# Altium schematic sheet [2]_FPGA.SchDoc: FPGA
size A3; Author: Eladio Delgado Mingorance; CompanyName: Mareldem Technologies; Organization: Mareldem Technologies; Revision: 1.0A; SheetNumber: 2; SheetTotal: 5
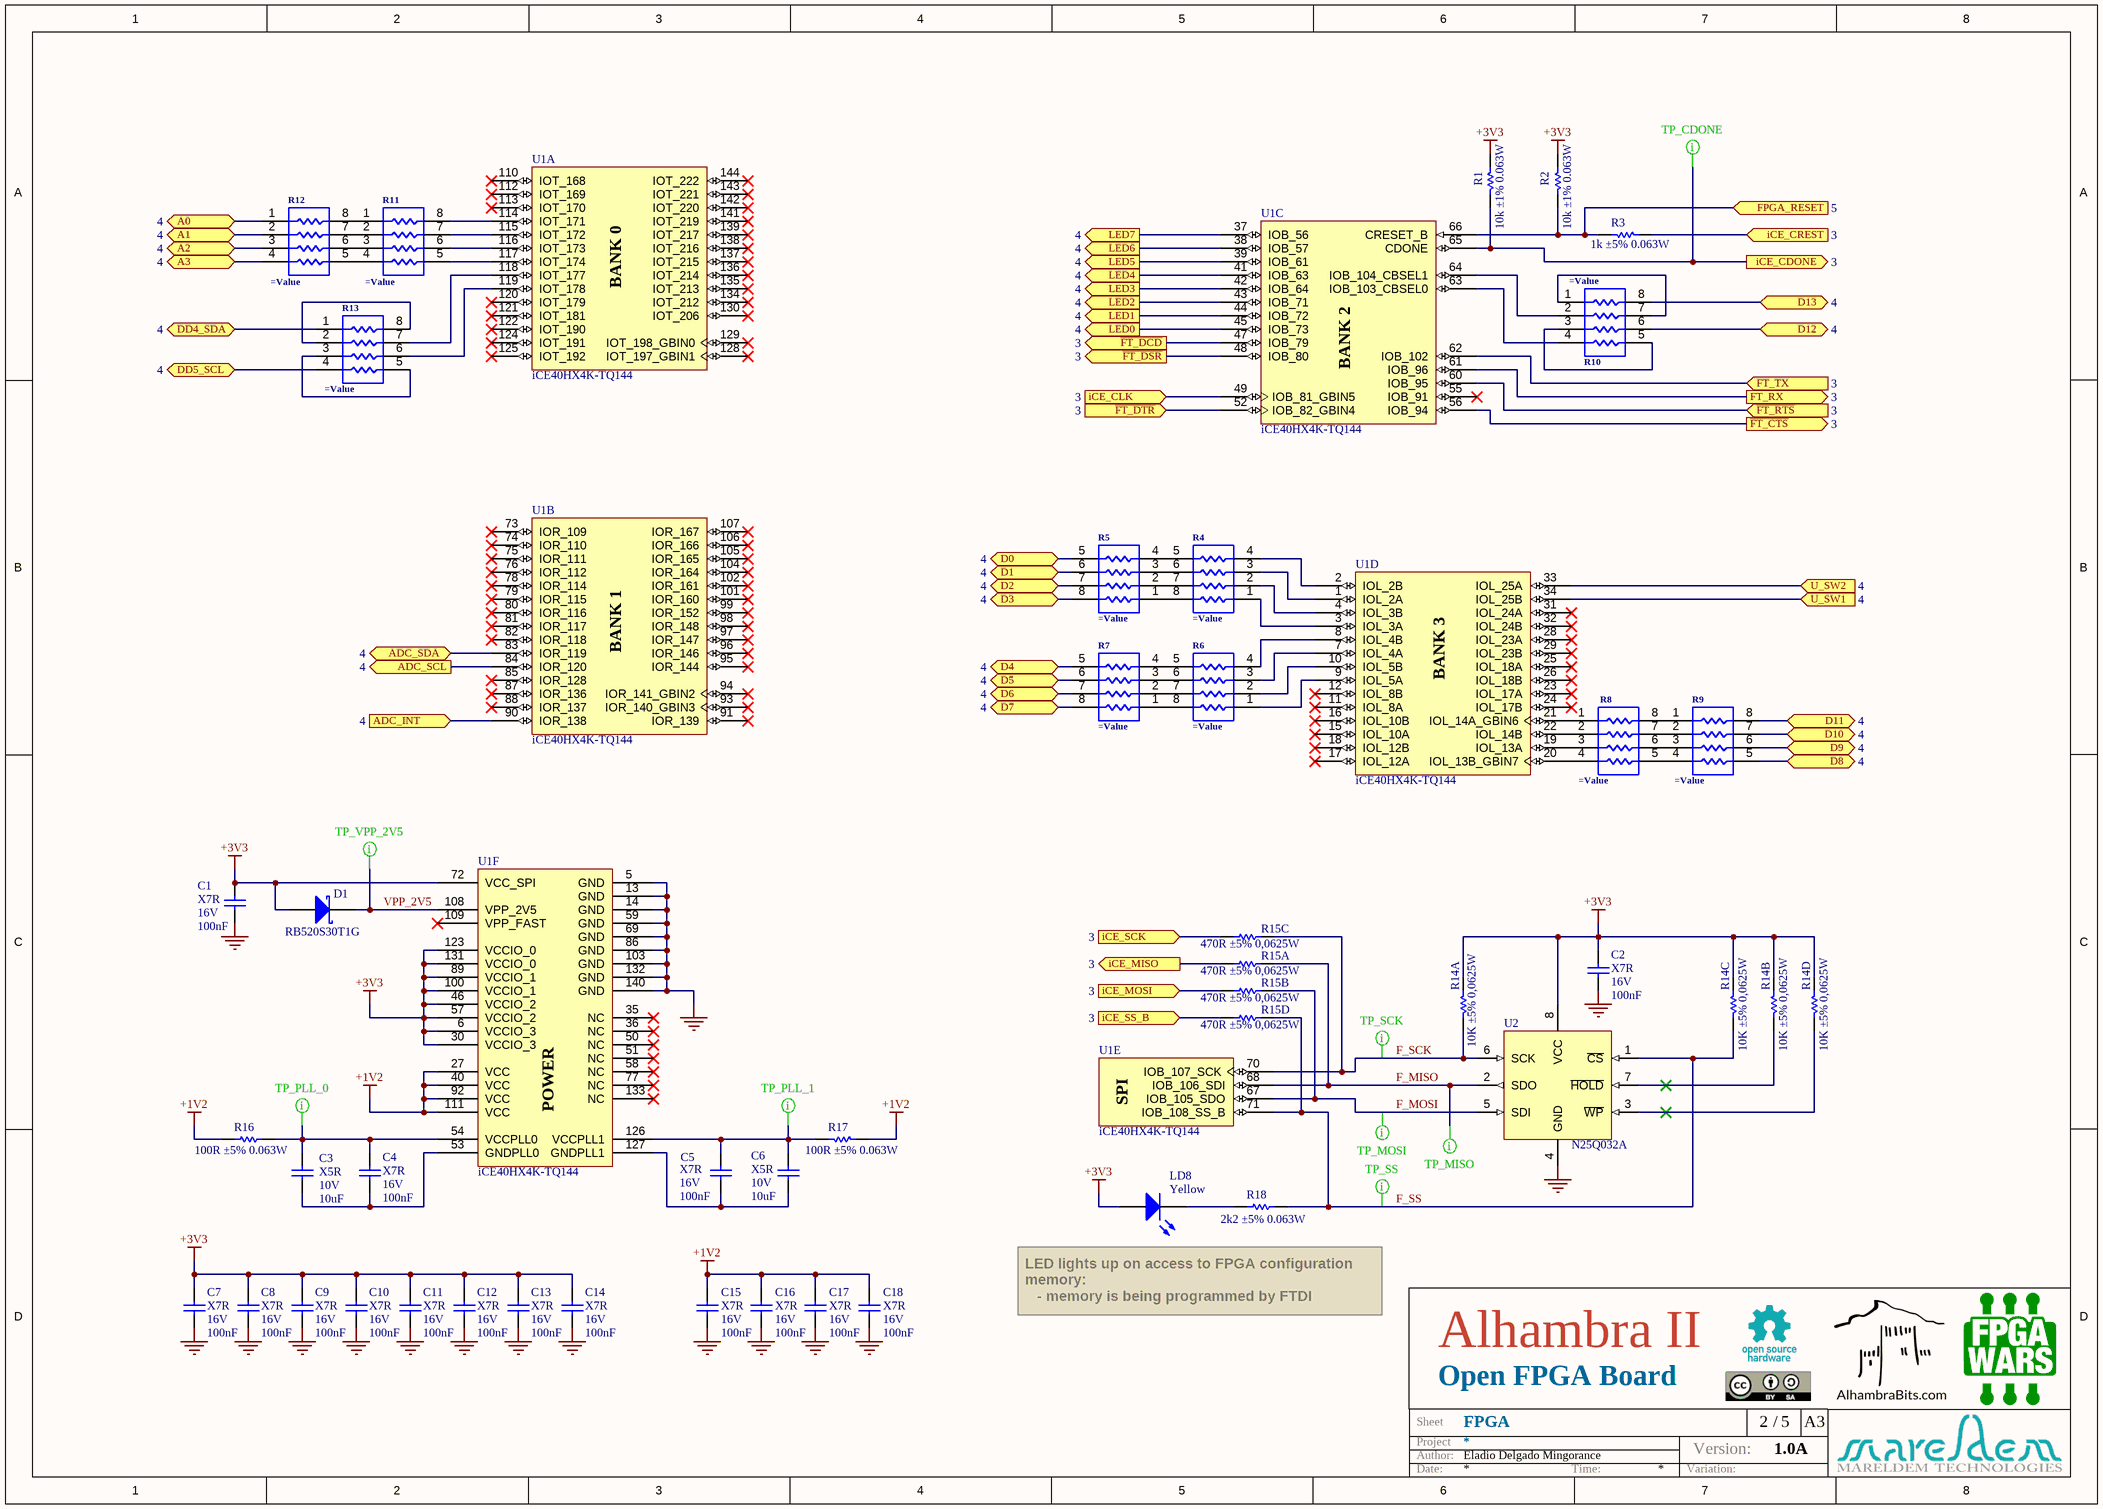
[diagram p0: [2]_FPGA.SchDoc]

## Parts
C1  Dielectric: X7R  Voltage: 16V  Capacitance: 100nF  [C0402]  (hidden comment: Capacitor)
C2  Dielectric: X7R  Voltage: 16V  Capacitance: 100nF  [C0402]  (hidden comment: Capacitor)
C3  Dielectric: X5R  Voltage: 10V  Capacitance: 10uF  [C0603]  (hidden comment: Capacitor)
C4  Dielectric: X7R  Voltage: 16V  Capacitance: 100nF  [C0402]  (hidden comment: Capacitor)
C5  Dielectric: X7R  Voltage: 16V  Capacitance: 100nF  [C0402]  (hidden comment: Capacitor)
C6  Dielectric: X5R  Voltage: 10V  Capacitance: 10uF  [C0603]  (hidden comment: Capacitor)
C7  Dielectric: X7R  Voltage: 16V  Capacitance: 100nF  [C0402]  (hidden comment: Capacitor)
C8  Dielectric: X7R  Voltage: 16V  Capacitance: 100nF  [C0402]  (hidden comment: Capacitor)
C9  Dielectric: X7R  Voltage: 16V  Capacitance: 100nF  [C0402]  (hidden comment: Capacitor)
C10  Dielectric: X7R  Voltage: 16V  Capacitance: 100nF  [C0402]  (hidden comment: Capacitor)
C11  Dielectric: X7R  Voltage: 16V  Capacitance: 100nF  [C0402]  (hidden comment: Capacitor)
C12  Dielectric: X7R  Voltage: 16V  Capacitance: 100nF  [C0402]  (hidden comment: Capacitor)
C13  Dielectric: X7R  Voltage: 16V  Capacitance: 100nF  [C0402]  (hidden comment: Capacitor)
C14  Dielectric: X7R  Voltage: 16V  Capacitance: 100nF  [C0402]  (hidden comment: Capacitor)
C15  Dielectric: X7R  Voltage: 16V  Capacitance: 100nF  [C0402]  (hidden comment: Capacitor)
C16  Dielectric: X7R  Voltage: 16V  Capacitance: 100nF  [C0402]  (hidden comment: Capacitor)
C17  Dielectric: X7R  Voltage: 16V  Capacitance: 100nF  [C0402]  (hidden comment: Capacitor)
C18  Dielectric: X7R  Voltage: 16V  Capacitance: 100nF  [C0402]  (hidden comment: Capacitor)
D1  RB520S30T1G  [SOD523]
LD8  Yellow  [LED0603]
R1  value 10k ±1% 0.063W  [R0402]  (hidden comment: Resistor)
R2  value 10k ±1% 0.063W  [R0402]  (hidden comment: Resistor)
R3  value 1k ±5% 0.063W  [R0402]  (hidden comment: Resistor)
R4  (no value)  [4xArray_1206_Convex]
R5  (no value)  [4xArray_1206_Convex]
R6  (no value)  [4xArray_1206_Convex]
R7  (no value)  [4xArray_1206_Convex]
R8  (no value)  [4xArray_1206_Convex]
R9  (no value)  [4xArray_1206_Convex]
R10  (no value)  [4xArray_1206_Convex]
R11  (no value)  [4xArray_1206_Convex]
R12  (no value)  [4xArray_1206_Convex]
R13  (no value)  [4xArray_1206_Convex]
R14  value 10K ±5% 0,0625W  [4xArray_1206_Convex]  (hidden comment: Resistor_x4_Parts)  (parts A,B,C,D of 4)
R15  value 470R ±5% 0,0625W  [4xArray_1206_Convex]  (hidden comment: Resistor_x4_Parts)  (parts A,B,C,D of 4)
R16  value 100R ±5% 0.063W  [R0402]  (hidden comment: Resistor)
R17  value 100R ±5% 0.063W  [R0402]  (hidden comment: Resistor)
R18  value 2k2 ±5% 0.063W  [R0402]  (hidden comment: Resistor)
U1  iCE40HX4K-TQ144  [TQFP-144_HX4K_FPGAwars]  (parts A,B,C,D,E,F of 6)
U2  N25Q032A  [DFN-8 6x5mm]

## Ports
A0 (bidir, see 4), A1 (bidir, see 4), A2 (bidir, see 4), A3 (bidir, see 4), ADC_INT (in, see 4), ADC_SCL (out, see 4), ADC_SDA (bidir, see 4), D0 (bidir, see 4), D1 (bidir, see 4), D2 (bidir, see 4), D3 (bidir, see 4), D4 (bidir, see 4), D5 (bidir, see 4), D6 (bidir, see 4), D7 (bidir, see 4), D8 (bidir, see 4), D9 (bidir, see 4), D10 (bidir, see 4), D11 (bidir, see 4), D12 (bidir, see 4), D13 (bidir, see 4), DD4_SDA (bidir, see 4), DD5_SCL (bidir, see 4), FPGA_RESET (in, see 5), FT_RX (out, see 3), FT_TX (in, see 3), iCE_CDONE (out, see 3), iCE_CLK (in, see 3), iCE_CREST (in, see 3), iCE_MISO (out, see 3), iCE_MOSI (in, see 3), iCE_SCK (in, see 3), iCE_SS_B (in, see 3), LED0 (out, see 4), LED1 (out, see 4), LED2 (out, see 4), LED3 (out, see 4), LED4 (out, see 4), LED5 (out, see 4), LED6 (out, see 4), LED7 (out, see 4), U_SW1 (in, see 4), U_SW2 (in, see 4), ~{FT_CTS} (out, see 3), ~{FT_DCD} (out, see 3), ~{FT_DSR} (out, see 3), ~{FT_DTR} (in, see 3), ~{FT_RTS} (in, see 3)

## Nets
+1V2: C15.2 C16.2 C17.2 C18.2 R16.2 R17.2 U1.27(VCC) U1.40(VCC) U1.92(VCC) U1.111(VCC)
+3V3: C1.2 C2.1 C7.2 C8.2 C9.2 C10.2 C11.2 C12.2 C13.2 C14.2 D1.A LD8.A R1.1 R2.1 R14.1 R14.2 R14.3 R14.4 U1.6(VCCIO_3) U1.30(VCCIO_3) U1.46(VCCIO_2) U1.57(VCCIO_2) U1.72(VCC_SPI) U1.89(VCCIO_1) U1.100(VCCIO_1) U1.123(VCCIO_0) U1.131(VCCIO_0) U2.8(VCC)
GND: C1.1 C2.2 C7.1 C8.1 C9.1 C10.1 C11.1 C12.1 C13.1 C14.1 C15.1 C16.1 C17.1 C18.1 U1.5(GND) U1.13(GND) U1.14(GND) U1.59(GND) U1.69(GND) U1.86(GND) U1.103(GND) U1.132(GND) U1.140(GND) U2.4(GND)
~{FT_CTS}: U1.56(IOB_94) ; port ~{FT_CTS}
~{FT_DCD}: U1.47(IOB_79) ; port ~{FT_DCD}
~{FT_DSR}: U1.48(IOB_80) ; port ~{FT_DSR}
~{FT_DTR}: U1.52(IOB_82_GBIN4) ; port ~{FT_DTR}
~{FT_RTS}: U1.60(IOB_95) ; port ~{FT_RTS}
A0: R12.1 ; port A0
A1: R12.2 ; port A1
A2: R12.3 ; port A2
A3: R12.4 ; port A3
ADC_INT: U1.90(IOR_138) ; port ADC_INT
ADC_SCL: U1.84(IOR_120) ; port ADC_SCL
ADC_SDA: U1.83(IOR_119) ; port ADC_SDA
D0: R5.5 ; port D0
D1: R5.6 ; port D1
D2: R5.7 ; port D2
D3: R5.8 ; port D3
D4: R7.5 ; port D4
D5: R7.6 ; port D5
D6: R7.7 ; port D6
D7: R7.8 ; port D7
D8: R9.5 ; port D8
D9: R9.6 ; port D9
D10: R9.7 ; port D10
D11: R9.8 ; port D11
D12: R10.6 ; port D12
D13: R10.8 ; port D13
DD4_SDA: R13.1 ; port DD4_SDA
DD5_SCL: R13.4 ; port DD5_SCL
F_MISO: R15.8 U1.68(IOB_106_SDI) U2.2(SDO)
F_MOSI: R15.7 U1.67(IOB_105_SDO) U2.5(SDI)
F_SCK: R14.8 R15.6 U1.70(IOB_107_SCK) U2.6(SCK)
F_SS: R14.6 R15.5 R18.2 U1.71(IOB_108_SS_B) U2.1(~{CS})
FPGA_RESET: R2.2 R3.2 U1.66(CRESET_B) ; port FPGA_RESET
FT_RX: U1.61(IOB_96) ; port FT_RX
FT_TX: U1.62(IOB_102) ; port FT_TX
iCE_CDONE: R1.2 U1.65(CDONE) ; port iCE_CDONE
iCE_CLK: U1.49(IOB_81_GBIN5) ; port iCE_CLK
iCE_CREST: R3.1 ; port iCE_CREST
iCE_MISO: R15.1 ; port iCE_MISO
iCE_MOSI: R15.2 ; port iCE_MOSI
iCE_SCK: R15.3 ; port iCE_SCK
iCE_SS_B: R15.4 ; port iCE_SS_B
LED0: U1.45(IOB_73) ; port LED0
LED1: U1.44(IOB_72) ; port LED1
LED2: U1.43(IOB_71) ; port LED2
LED3: U1.42(IOB_64) ; port LED3
LED4: U1.41(IOB_63) ; port LED4
LED5: U1.39(IOB_61) ; port LED5
LED6: U1.38(IOB_57) ; port LED6
LED7: U1.37(IOB_56) ; port LED7
U_SW1: U1.34(IOL_25B) ; port U_SW1
U_SW2: U1.33(IOL_25A) ; port U_SW2
VPP_2V5: D1.k(K) U1.108(VPP_2V5)
NetC3_1: C3.1 C4.2 R16.1 U1.54(VCCPLL0)
NetC3_2: C3.2 C4.1 U1.53(GNDPLL0)
NetC5_1: C5.1 C6.1 U1.127(GNDPLL1)
NetC5_2: C5.2 C6.2 R17.1 U1.126(VCCPLL1)
NetLD8_K: LD8.K R18.1
NetR4_1: R4.1 U1.3(IOL_3A)
NetR4_2: R4.2 U1.4(IOL_3B)
NetR4_3: R4.3 U1.1(IOL_2A)
NetR4_4: R4.4 U1.2(IOL_2B)
NetR4_5: R4.5 R5.4
NetR4_6: R4.6 R5.3
NetR4_7: R4.7 R5.2
NetR4_8: R4.8 R5.1
NetR6_1: R6.1 U1.9(IOL_5A)
NetR6_2: R6.2 U1.10(IOL_5B)
NetR6_3: R6.3 U1.7(IOL_4A)
NetR6_4: R6.4 U1.8(IOL_4B)
NetR6_5: R6.5 R7.4
NetR6_6: R6.6 R7.3
NetR6_7: R6.7 R7.2
NetR6_8: R6.8 R7.1
NetR8_1: R8.1 U1.21(IOL_14A_GBIN6)
NetR8_2: R8.2 U1.22(IOL_14B)
NetR8_3: R8.3 U1.19(IOL_13A)
NetR8_4: R8.4 U1.20(IOL_13B_GBIN7)
NetR8_5: R8.5 R9.4
NetR8_6: R8.6 R9.3
NetR8_7: R8.7 R9.2
NetR8_8: R8.8 R9.1
NetR10_1: R10.1 R10.7
NetR10_2: R10.2 U1.64(IOB_104_CBSEL1)
NetR10_3: R10.3 R10.5
NetR10_4: R10.4 U1.63(IOB_103_CBSEL0)
NetR11_1: R11.1 R12.8
NetR11_2: R11.2 R12.7
NetR11_3: R11.3 R12.6
NetR11_4: R11.4 R12.5
NetR11_5: R11.5 U1.117(IOT_174)
NetR11_6: R11.6 U1.116(IOT_173)
NetR11_7: R11.7 U1.115(IOT_172)
NetR11_8: R11.8 U1.114(IOT_171)
NetR13_2: R13.2 R13.8
NetR13_3: R13.3 R13.5
NetR13_6: R13.6 U1.119(IOT_178)
NetR13_7: R13.7 U1.118(IOT_177)
NetR14_5: R14.5 U2.3(~{WP})
NetR14_7: R14.7 U2.7(~{HOLD})

Not connected (* = marked no-connect by the designer): U1 11(IOL_8A)* 12(IOL_8B)* 15(IOL_10A)* 16(IOL_10B)* 17(IOL_12A)* 18(IOL_12B)* 23(IOL_17A)* 24(IOL_17B)* 25(IOL_18A)* 26(IOL_18B)* 28(IOL_23A)* 29(IOL_23B)* 31(IOL_24A)* 32(IOL_24B)* 35(NC)* 36(NC)* 50(NC)* 51(NC)* 55(IOB_91)* 58(NC)* 73(IOR_109)* 74(IOR_110)* 75(IOR_111)* 76(IOR_112)* 77(NC)* 78(IOR_114)* 79(IOR_115)* 80(IOR_116)* 81(IOR_117)* 82(IOR_118)* 85(IOR_128)* 87(IOR_136)* 88(IOR_137)* 91(IOR_139)* 93(IOR_140_GBIN3)* 94(IOR_141_GBIN2)* 95(IOR_144)* 96(IOR_146)* 97(IOR_147)* 98(IOR_148)* 99(IOR_152)* 101(IOR_160)* 102(IOR_161)* 104(IOR_164)* 105(IOR_165)* 106(IOR_166)* 107(IOR_167)* 109(VPP_FAST)* 110(IOT_168)* 112(IOT_169)* 113(IOT_170)* 120(IOT_179)* 121(IOT_181)* 122(IOT_190)* 124(IOT_191)* 125(IOT_192)* 128(IOT_197_GBIN1)* 129(IOT_198_GBIN0)* 130(IOT_206)* 133(NC)* 134(IOT_212)* 135(IOT_213)* 136(IOT_214)* 137(IOT_215)* 138(IOT_216)* 139(IOT_217)* 141(IOT_219)* 142(IOT_220)* 143(IOT_221)* 144(IOT_222)*

## Layout directives
net class Test Points: F_MISO, F_MOSI, F_SCK, F_SS, iCE_CDONE, NetC3_1, NetC5_2, VPP_2V5

## Notes on the sheet
- LED lights up on access to FPGA configuration memory:
  - memory is being programmed by FTDI
  - memory is being read by FPGA after reset or power-on
- Alhambra II
- Open FPGA Board
- Project
- Sheet
- Author:
- Version:
- /
- A3
- Date:
- Time:
- Variation:
- (in symbol iCE40-HX4K, part A) BANK 0
- (in symbol iCE40-HX4K, part B) BANK 1
- (in symbol iCE40-HX4K, part C) BANK 2
- (in symbol iCE40-HX4K, part D) BANK 3
- (in symbol iCE40-HX4K, part E) SPI
- (in symbol iCE40-HX4K, part F) POWER

## Library data of the parts
C1 C2 C4 C5 C7-C18 = C0402_100nF_16V_±10%: Capacitor SMD; Manufacturer: Kemet; Value: 100nF ±10% 16V; Tolerance: ±10%; OrderingCode: C0402C104K4RAC; Temp_ Max: 125; Temp_ Min: -55; Part Number: C0402_100nF_16V_±10%; Price (€): 0,05
C3 C6 = C0603_10uF_10V_±10%: Capacitor SMD; Manufacturer: Murata; Value: 10uF ±10% 10V; Tolerance: ±10%; OrderingCode: GRM188R61A106KE69D; Temp_ Max: 85; Temp_ Min: -55; Part Number: C0603_10uF_10V_±10%; Price (€): 0,027
D1 = RB520S30T1G: Schottky Diode; Manufacturer: On Semiconductor; Ifor: 200mA; Vrrm: 30V; Ifsm: 300mA; Vf: 0,35V; Temp_ Max: 150; Temp_ Min: -55; Value: 200mA 30V; Part Number: RB520S30T1G; OrderingCode: RB520S30T1G; Price (€): 0,017
LD8 = LED Yellow 0603 Wurth: LED; Manufacturer: WE; OrderingCode: 150 060 YS7 5000; Temp_ Max: 85; Temp_ Min: -40; Part Number: LED Yellow 0603 Wurth; Price (€): 0,07; Value: Yellow
R1 R2 = R0402_10k_0.063W_±1%: Resistor, SMD; Manufacturer: Vishay; Tolerance: ±1%; OrderingCode: CRCW040210K0FK; Power: 0.063W; Resistance: 10k; Temp_ Max: 155; Temp_ Min: -55; PackageDescription: SMD; Part Number: R0402_10k_0.063W_±1%; Price (€): 0,006
R3 = R0402_1k_0.063W_±5%: Resistor, SMD; Manufacturer: Vishay; Tolerance: ±5%; OrderingCode: CRCW04021K00JN; Power: 0.063W; Resistance: 1k; Temp_ Max: 155; Temp_ Min: -55; PackageDescription: SMD; Part Number: R0402_1k_0.063W_±5%; Price (€): 0,003
R4-R13 = 4xArray_1206_Convex_100R_0,0625W_0,05: Resistor, Array 4x1; Manufacturer: Yageo; Resistance: 100R; Tolerance: 5%; OrderingCode: YC164-JR-07100RL; Temp_ Max: 155; Temp_ Min: -25; Value: 100R 5% 0,0625W; Part Number: 4xArray_1206_Convex_100R_0,0625W_0,05; Power: 0,0625W; Price (€): 0,005
R14 = 4xArray_1206_Convex_10K_0,0625W_±5%: Resistor; Manufacturer: Yageo; Tolerance: ±5%; OrderingCode: YC164-JR-0710KL; Resistance: 10K; Temp_ Max: 155; Temp_ Min: -55; PackageDescription: SMD; Power: 0,0625W; Part Number: 4xArray_1206_Convex_10K_0,0625W_±5%; Price (€): 0,006
R15 = 4xArray_1206_Convex_470R_0,0625W_±5%: Resistor; Manufacturer: Yageo; Tolerance: ±5%; OrderingCode: YC164-JR-07470RL; Resistance: 470R; Temp_ Max: 155; Temp_ Min: -25; PackageDescription: SMD; Power: 0,0625W; Part Number: 4xArray_1206_Convex_470R_0,0625W_±5%; Price (€): 0,006
R16 R17 = R0402_100R_0.063W_±5%: Resistor, SMD; Manufacturer: Vishay; Tolerance: ±5%; OrderingCode: CRCW0402100RJN; Power: 0.063W; Resistance: 100R; Temp_ Max: 155; Temp_ Min: -55; PackageDescription: SMD; Part Number: R0402_100R_0.063W_±5%; Price (€): 0,003
R18 = R0402_2k2_0.063W_±5%: Resistor, SMD; Manufacturer: Vishay; Tolerance: ±5%; OrderingCode: CRCW04022K20JN; Power: 0.063W; Resistance: 2k2; Temp_ Max: 155; Temp_ Min: -55; PackageDescription: SMD; Part Number: R0402_2k2_0.063W_±5%; Price (€): 0,003
U1 = iCE40-HX4K: iCE40 HX4K Series FPGA Family, 3520 Logic Cells, 1.2 V Core, 80 K Embedded RAM Bits, 144-pin TQFP, Pb-Free, Tray; Manufacturer: Lattice; Temp_ Max: 85; Temp_ Min: -40; Part Number: iCE40-HX4K; OrderingCode: iCE40HX4K-TQ144; Price (€): 6
U2 = N25Q032A: NOR Flash Memory, serial; Manufacturer: Micron; OrderingCode: N25Q032A13EF640E; Temp_ Max: 85; Temp_ Min: -40; OrderingCode 2: S25FL032P0XNFI011; Value: 32Mb; Part Number: N25Q032A; Supplier: Silica; Price (€): 0,9; Manufacturer 2: Spansion